# EAGLE schematic MSP430G2553IN28_Test2 (EAGLE 6.5.0)
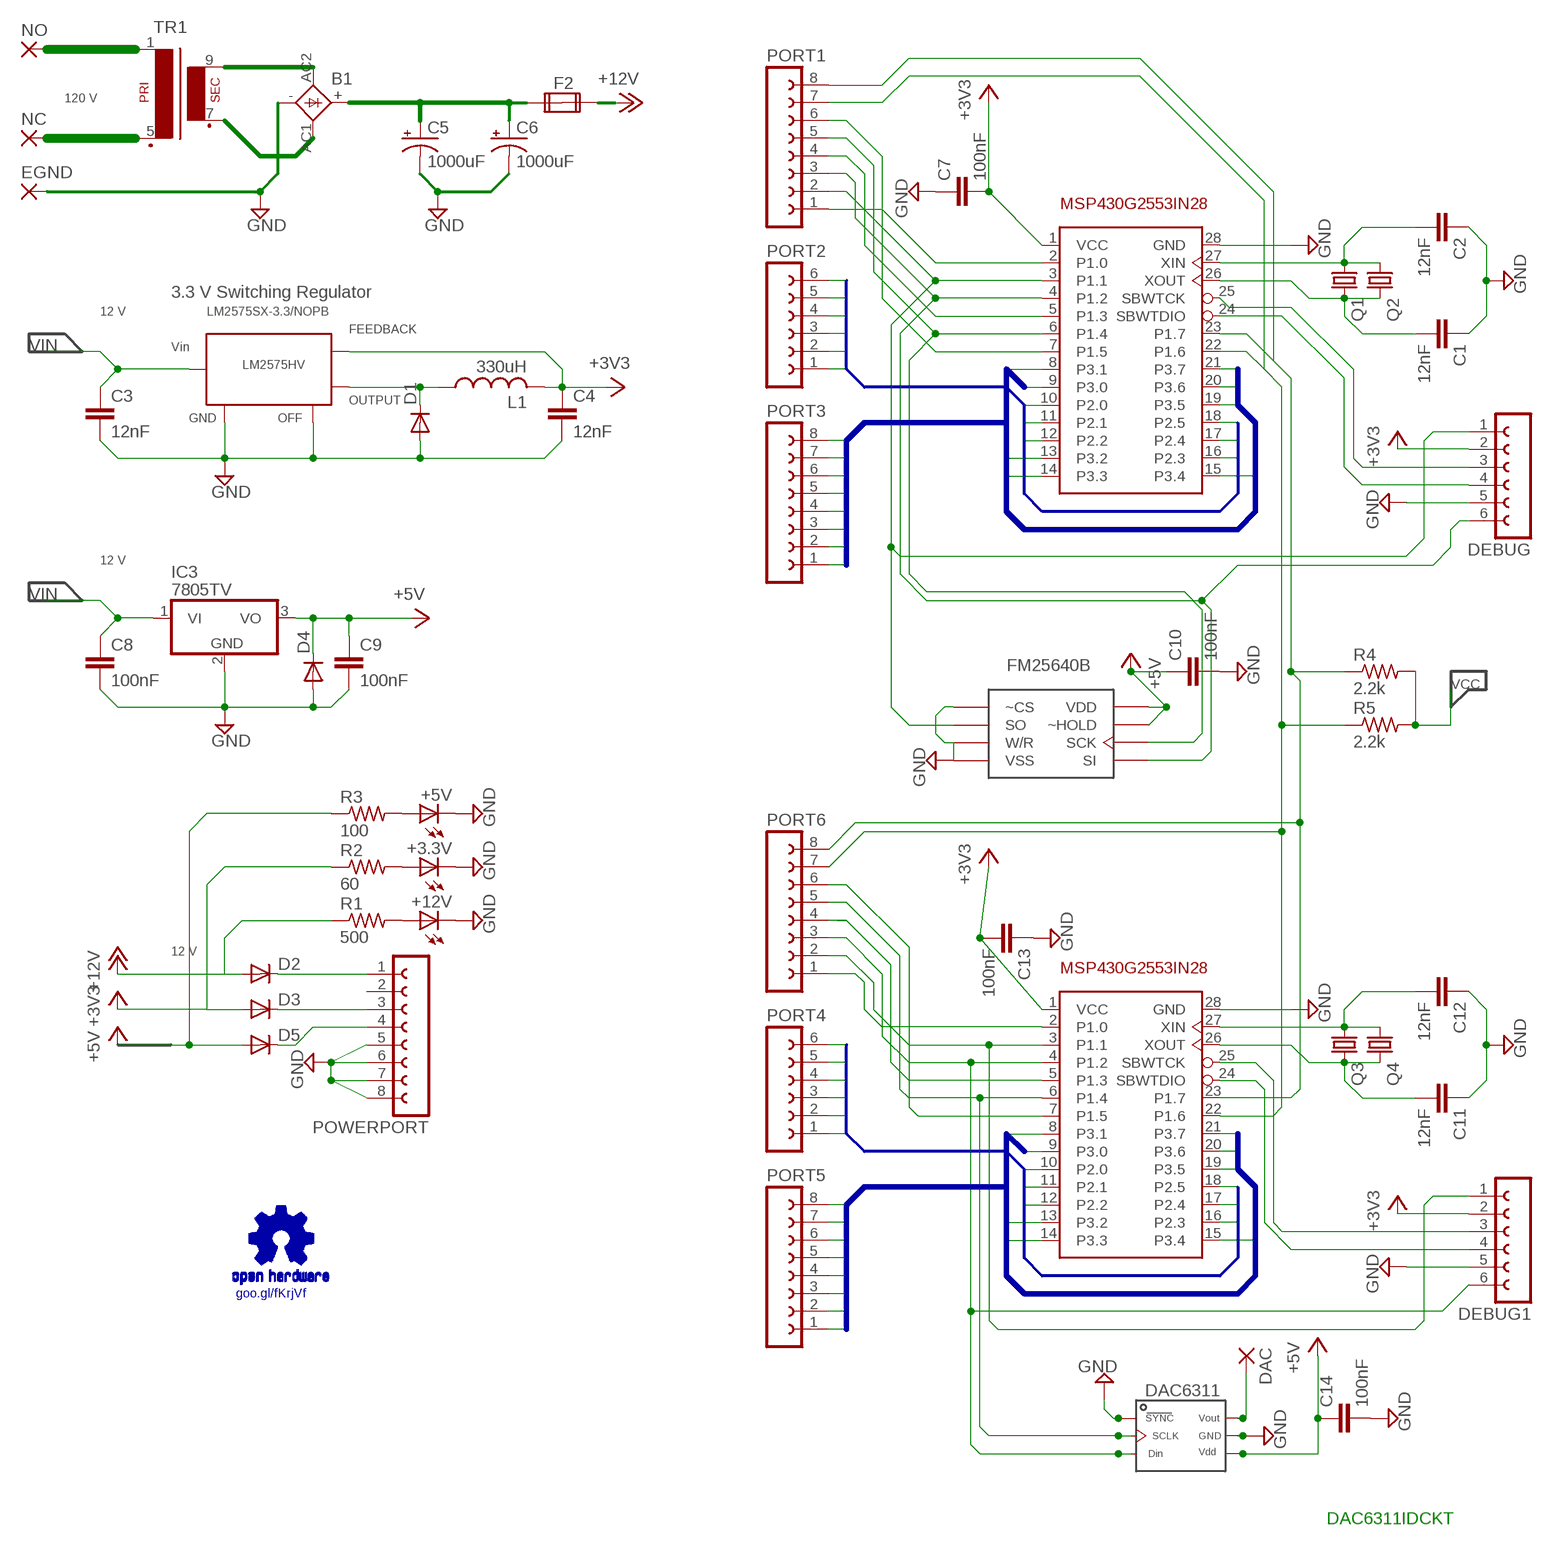
[diagram p0: schematic, sheet 1]

## Parts
+3.3V  LEDSML0603  [SML0603]
+5V  LEDSML0603  [SML0603]
+12V  LEDSML0603  [SML0603]
B1  GBU4  [GBU4S]
C1  12nF  C-EUC0402  [C0402]
C2  12nF  C-EUC0402  [C0402]
C3  12nF  C-EUC0402  [C0402]
C4  12nF  C-EUC0402  [C0402]
C5  1000uF  CPOL-USE5-8.5  [E5-8,5]
C6  1000uF  CPOL-USE5-8.5  [E5-8,5]
C7  100nF  C-EUC0402  [C0402]
C8  100nF  C-EUC0402  [C0402]
C9  100nF  C-EUC0402  [C0402]
C10  100nF  C-EUC0402  [C0402]
C11  12nF  C-EUC0402  [C0402]
C12  12nF  C-EUC0402  [C0402]
C13  100nF  C-EUC0402  [C0402]
C14  100nF  C-EUC0402  [C0402]
D1  DIODE-SOD106-R  [SOD106-R]
D2  DIODE-DO41-7.6  [DO41-7.6]
D3  DIODE-DO41-7.6  [DO41-7.6]
D4  DIODE-SOD106-R  [SOD106-R]
D5  DIODE-DO41-7.6  [DO41-7.6]
DAC  1,6/0,8  [1,6/0,8]
DEBUG  FE06-1  [FE06]
DEBUG1  FE06-1  [FE06]
EGND  3,81/1,4  [3,81/1,4]
F2  FUSE2P  [FUSE1]
IC1  MSP430  [P-TSSOP28-1]
IC2  FM25640BSO8  [SO08]
IC3  7805TV  [TO220V]
IC4  MSP430  [P-TSSOP28-1]
IC5  DAC6311  [SC70-6]
IC6  CUSTOM_REGULATOR  [TO263-5]
L1  330uH  L-USL1812  [L1812]
NC  3,81/1,4  [3,81/1,4]
NO  3,81/1,4  [3,81/1,4]
PORT1  FE08-1  [FE08]
PORT2  FE06-1  [FE06]
PORT3  FE08-1  [FE08]
PORT4  FE06-1  [FE06]
PORT5  FE08-1  [FE08]
PORT6  FE08-1  [FE08]
POWERPORT  FE08-1  [FE08]
Q1  CRYSTALTC26H  [TC26H]
Q2  CRYSTALHC49U-V  [HC49U-V]
Q3  CRYSTALTC26H  [TC26H]
Q4  CRYSTALHC49U-V  [HC49U-V]
R1  500  R-US_R0402  [R0402]
R2  60  R-US_R0402  [R0402]
R3  100  R-US_R0402  [R0402]
R4  2.2k  R-US_R0402  [R0402]
R5  2.2k  R-US_R0402  [R0402]
TR1  VV11  [VV11]

## Nets
+3V3: C4.1 C7.2 C13.2 D3.A DEBUG1.2 IC1.1(VCC) IC4.1(VCC) IC6.4 L1.2 R2.1
+5V: C9.1 C10.1 C14.1 D5.A IC2.7(~HOLD) IC2.8(VDD) IC5.4 R3.1
+12V: D2.A F2.2A R1.1
GND: +3.3V.C +5V.C +12V.C B1.- C1.1 C2.1 C3.2 C4.2 C5.- C6.- C7.1 C8.2 C9.2 C10.2 C11.1 C12.1 C13.1 C14.2 D1.A D4.A DEBUG1.5 DEBUG.5 EGND.1(P) IC1.28(GND) IC2.1(~CS) IC2.3(W/R) IC2.4(VSS) IC3.2(GND) IC4.28(GND) IC5.1 IC5.5 IC6.3 IC6.5 IC6.6 POWERPORT.5 POWERPORT.6 POWERPORT.7 POWERPORT.8
I2C0: IC1.23(P1.7) IC4.23(P1.7) PORT1.8 PORT6.8 R4.1
I2C1: IC1.22(P1.6) IC4.22(P1.6) PORT1.7 PORT6.7 R5.1
N$1: C2.2 IC1.27(XIN) Q1.1 Q2.1
N$2: C1.2 IC1.26(XOUT) Q1.2 Q2.2
N$3: NC.1(P) TR1.5(P2)
N$4: NO.1(P) TR1.1
N$5: +12V.A R1.2
N$6: +3.3V.A R2.2
N$7: D2.C POWERPORT.1
N$8: D3.C POWERPORT.3
N$9: B1.AC2(AC1) TR1.9(S4)
N$10: B1.AC1(AC2) TR1.7(S3)
N$11: C12.2 IC4.27(XIN) Q3.1 Q4.1
N$12: C11.2 IC4.26(XOUT) Q3.2 Q4.2
N$13: D5.C POWERPORT.4
N$14: +5V.A R3.2
N$15: DAC.1(P) IC5.6
N$20: DEBUG1.3 IC4.25(SBWTCK)
N$21: DEBUG1.4 IC4.24(SBWTDIO)
N$22: DEBUG.3 IC1.25(SBWTCK)
N$23: DEBUG.4 IC1.24(SBWTDIO)
N$33: B1.+ C5.+ C6.+ F2.1A
P$2: D1.C IC6.2 L1.1
PORT1_0: IC1.2(P1.0) PORT1.1
PORT1_1: DEBUG.1 IC1.3(P1.1) IC2.2(SO) PORT1.2
PORT1_2: DEBUG.6 IC1.4(P1.2) IC2.5(SI) PORT1.3
PORT1_3: IC1.5(P1.3) PORT1.4
PORT1_4: IC1.6(P1.4) IC2.6(SCK) PORT1.5
PORT1_5: IC1.7(P1.5) PORT1.6
PORT1__0: IC4.2(P1.0) PORT6.1
PORT1__1: DEBUG1.1 IC4.3(P1.1) PORT6.2
PORT1__2: DEBUG1.6 IC4.4(P1.2) IC5.3 PORT6.3
PORT1__3: IC4.5(P1.3) PORT6.4
PORT1__4: IC4.6(P1.4) IC5.2 PORT6.5
PORT1__5: IC4.7(P1.5) PORT6.6
PORT2_0: IC1.10(P2.0) PORT2.1
PORT2_1: IC1.11(P2.1) PORT2.2
PORT2_2: IC1.12(P2.2) PORT2.3
PORT2_3: IC1.16(P2.3) PORT2.4
PORT2_4: IC1.17(P2.4) PORT2.5
PORT2_5: IC1.18(P2.5) PORT2.6
PORT2__0: IC4.10(P2.0) PORT4.1
PORT2__1: IC4.11(P2.1) PORT4.2
PORT2__2: IC4.12(P2.2) PORT4.3
PORT2__3: IC4.16(P2.3) PORT4.4
PORT2__4: IC4.17(P2.4) PORT4.5
PORT2__5: IC4.18(P2.5) PORT4.6
PORT3_0: IC1.9(P3.0) PORT3.1
PORT3_1: IC1.8(P3.1) PORT3.2
PORT3_2: IC1.13(P3.2) PORT3.3
PORT3_3: IC1.14(P3.3) PORT3.4
PORT3_4: IC1.15(P3.4) PORT3.5
PORT3_5: IC1.19(P3.5) PORT3.6
PORT3_6: IC1.20(P3.6) PORT3.7
PORT3_7: IC1.21(P3.7) PORT3.8
PORT3__0: IC4.9(P3.0) PORT5.1
PORT3__1: IC4.8(P3.1) PORT5.2
PORT3__2: IC4.13(P3.2) PORT5.3
PORT3__3: IC4.14(P3.3) PORT5.4
PORT3__4: IC4.15(P3.4) PORT5.5
PORT3__5: IC4.19(P3.5) PORT5.6
PORT3__6: IC4.20(P3.6) PORT5.7
PORT3__7: IC4.21(P3.7) PORT5.8
VCC: R4.2 R5.2
VCC5: D4.C IC3.3(VO)
VIN: C3.1 C8.1 IC3.1(VI) IC6.1
Unconnected: DEBUG.2 F2.1B F2.2B POWERPORT.2

## Buses
PORT2__[0..5]
PORT3__[0..7]
PORT3_[0..7]
PORT2_[0..5]

## Notes on the sheet
- 120 V
- 3.3 V Switching Regulator
- 12 V | LM2575SX-3.3/NOPB
- 12 V
- 12 V
- goo.gl/fKrjVf
- DAC6311IDCKT

## Library data of the parts
+3.3V +5V +12V = led:LED: LED OSRAM: - CHIPLED LG R971, LG N971, LY N971, LG Q971, LY Q971, LO R971, LY R971 LH N974, LH R974 LS Q976, LO Q976, LY Q976 LO Q996 - Hyper CHIPLED LW Q18S LB Q993, LB Q99A, LB R99A - SideLED LS A670, LO A670, LY A670, LG A670, LP A670 LB A673, LV A673, LT A673, LW A673 LH A674 LY A675 LS A676, LA A676, LO A676, LY A676, LW A676 LS A679, LY A679, LG A679 - Hyper Micro SIDELED® LS Y876, LA Y876, LO Y876, LY Y876 LT Y87S - SmartLED LW L88C, LW L88S LB L89C, LB L89S, LG L890 LS L89K, LO L89K, LY L89K LS L896, LA L896, LO L896, LY L896 - TOPLED LS T670, LO T670, LY T670, LG T670, LP T670 LSG T670, LSP T670, LSY T670, LOP T670, LYG T670 LG T671, LOG T671, LSG T671 LB T673, LV T673, LT T673, LW T673 LH T674 LS T676, LA T676, LO T676, LY T676, LB T676, LH T676, LSB T676, LW T676 LB T67C, LV T67C, LT T67C, LS T67K, LO T67K, LY T67K, LW E67C LS E67B, LA E67B, LO E67B, LY E67B, LB E67C, LV E67C, LT E67C LW T67C LS T679, LY T679, LG T679 LS T770, LO T770, LY T770, LG T770, LP T770 LB T773, LV T773, LT T773, LW T773 LH T774 LS E675, LA E675, LY E675, LS T675 LS T776, LA T776, LO T776, LY T776, LB T776 LHGB T686 LT T68C, LB T68C - Hyper Mini TOPLED® LB M676 - Mini TOPLED Santana® LG M470 LS M47K, LO M47K, LY M47K Source: http://www.osram.convergy.de LUXEON: - LUMILED® LXK2-PW12-R00, LXK2-PW12-S00, LXK2-PW14-U00, LXK2-PW14-V00 LXK2-PM12-R00, LXK2-PM12-S00, LXK2-PM14-U00 LXK2-PE12-Q00, LXK2-PE12-R00, LXK2-PE12-S00, LXK2-PE14-T00, LXK2-PE14-U00 LXK2-PB12-K00, LXK2-PB12-L00, LXK2-PB12-M00, LXK2-PB14-N00, LXK2-PB14-P00, LXK2-PB14-Q00 LXK2-PR12-L00, LXK2-PR12-M00, LXK2-PR14-Q00, LXK2-PR14-R00 LXK2-PD12-Q00, LXK2-PD12-R00, LXK2-PD12-S00 LXK2-PH12-R00, LXK2-PH12-S00 LXK2-PL12-P00, LXK2-PL12-Q00, LXK2-PL12-R00 Source: www.luxeon.com KINGBRIGHT: KA-3528ASYC Source: www.kingbright.com
B1 = rectifier:GBU4: GENERAL INSTRUMENT RECTIFIER
C1-C4 C7-C14 = rcl:C-EU: CAPACITOR, European symbol
C5 C6 = rcl:CPOL-US: POLARIZED CAPACITOR, American symbol
D1-D5 = diode:DIODE-: DIODE
DAC = wirepad:1,6/0,8: THROUGH-HOLE PAD
DEBUG DEBUG1 PORT2 PORT4 = con-lsta:FE06-1: FEMALE HEADER; OC_FARNELL: unknown; OC_NEWARK: unknown
EGND NC NO = wirepad:3,81/1,4: THROUGH-HOLE PAD
F2 = special:FUSE2P: FUSE 5 x 20 mm
IC1 IC4 = msp430_board:MSP430: Custom MSP430
IC2 = msp430_board:FM25640B: Custom RAM
IC3 = linear:78*: Positive VOLTAGE REGULATOR Source: http://cache.national.com/ds/LM/LM78L05.pdf http://www.fairchildsemi.com/ds/LM/LM7805.pdf
IC5 = msp430_board:DAC6311: Custom DAC
IC6 = msp430_board:CUSTOM_REGULATOR: Custom LM2575
L1 = rcl:L-US: INDUCTOR, American symbol
PORT1 PORT3 PORT5 PORT6 POWERPORT = con-lsta:FE08-1: FEMALE HEADER; OC_FARNELL: unknown; OC_NEWARK: unknown
Q1 Q3 = crystal:CRYSTAL: CRYSTAL; OC_FARNELL: unknown; OC_NEWARK: unknown
Q2 Q4 = crystal:CRYSTAL: CRYSTAL; OC_FARNELL: 1666969; OC_NEWARK: unknown
R1-R5 = rcl:R-US_: RESISTOR, American symbol
TR1 = trafo:VV11: TRANSFORMER 1 primary winding, 1 secondary winding BLOCK